# Altium project arduino_uno_PCB_Project.PrjPcb (part 2 of 2)
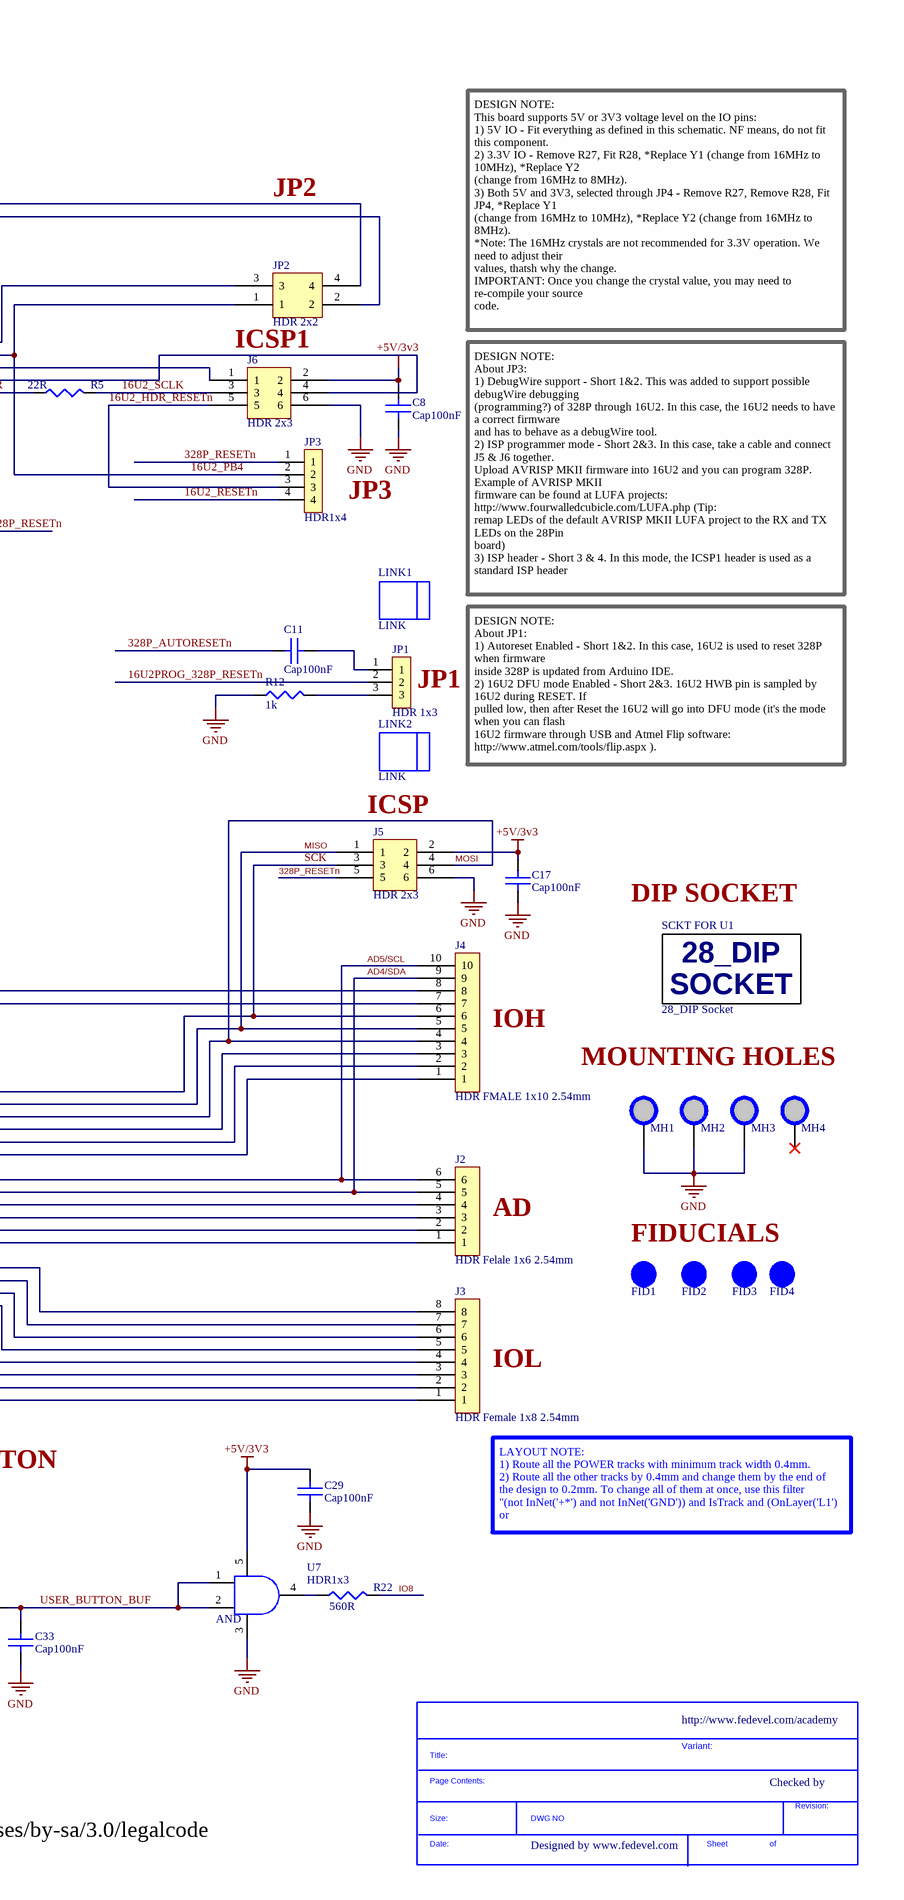
[diagram p4: [03] - 28PINS SCHEMATIC.SchDoc, right]

## Sheet [03] - 28PINS SCHEMATIC.SchDoc: 28Pins (continued)

### Library data of the parts
C1 C2 = EEE-1AA101WR: CAP ALUM 100UF 20% 10V SMD; Manufacturer: Panasonic; Ripple Current: 50mA; Life (Hours): 1000Hour; Supplier 1: Digi-Key; Supplier Part Number 1: PCE3867CT-ND; Manufacturer Part Number: EEE-1AA101WR; Stock 1: 0; Pricing 1: 1=0.35, 10=0.244, 50=0.1706, 100=0.1463, 500=0.10972 (USD); Mount: Surface Mount,PCB; Case/Package: Radial; Contact Plating: Tin; Min Operating Temperature: -40°C; Max Operating Temperature: 85°C; Capacitance: 100uF; Voltage Rating: 10V; Tolerance: 20%; Packaging: Tape and Reel; Package Quantity: 1; Ripple Current (AC): 50mA; Voltage Rating (DC): 10V; Termination: SMD/SMT; Series: S; Construction: Cylindrical; Diameter: 5mm; Length: 5.5mm; Height: 5.4mm; Height - Seated (Max): 0.213inch; Radiation Hardening: No; REACH SVHC: Unknown; Lead Free: Lead Free; RoHS Compliant: Yes; ComponentLink1URL: https://industrial.panasonic.com/cdbs/www-data/pdf/RDE0000/DME0000COL90.pdf?src-supplier=Mouser; ComponentLink1Description: https://industrial.panasonic.com/cdbs/www-data/pdf/RDE0000/DME0000COL90.pdf?src-supplier=Mouser; ComponentLink2URL: https://industrial.panasonic.com/cdbs/www-data/pdf/RDE0000/DME0000COL90.pdf?src-supplier=Allied+Electronics; ComponentLink2Description: https://industrial.panasonic.com/cdbs/www-data/pdf/RDE0000/DME0000COL90.pdf?src-supplier=Allied+Electronics; ComponentLink3URL: https://industrial.panasonic.com/cdbs/www-data/pdf/RDE0000/DME0000COL90.pdf?src-supplier=Avnet; ComponentLink3Description: https://industrial.panasonic.com/cdbs/www-data/pdf/RDE0000/DME0000COL90.pdf?src-supplier=Avnet; ComponentLink4URL: http://industrial.panasonic.com/www-data/pdf/ABA0000/ABA0000CE2.pdf?src-supplier=Future+Electronics; ComponentLink4Description: http://industrial.panasonic.com/www-data/pdf/ABA0000/ABA0000CE2.pdf?src-supplier=Future+Electronics; ComponentLink5URL: https://industrial.panasonic.com/cdbs/www-data/pdf/RDE0000/DME0000COL90.pdf?src-supplier=Verical; ComponentLink5Description: https://industrial.panasonic.com/cdbs/www-data/pdf/RDE0000/DME0000COL90.pdf?src-supplier=Verical; Category: Capacitors Aluminum Electrolytic Capacitors
C3 C12 C13 C19 C21 C22 C34 C? = C1608X6S0G106M080AC: TDK - C1608X6S0G106M080AC - Keramikvielschichtkondensator, SMD, 10 µF, 4 V, 0603 [Metrisch 1608], ± 20%, X6S, C Series; Dielectric Material: Ceramic; Capacitance: 10uF; Voltage Rating: 4V; Supplier 1: Digi-Key; Supplier Part Number 1: 445-7455-6-ND; Manufacturer: TDK; Manufacturer Part Number: C1608X6S0G106M080AC; Stock 1: 32195; Pricing 1: 1=0.36, 10=0.248, 50=0.1656, 100=0.1408, 500=0.09936, 1000=0.08694 (USD); Mount: Surface Mount; Case/Package: 0603; Number of Pins: 2; Case Code (Metric): 1608; Case Code (Imperial): 0603; Weight: 7.1E-05oz; Min Operating Temperature: -55°C; Max Operating Temperature: 105°C; Tolerance: 20%; Packaging: Tape and Reel; Package Quantity: 1; Voltage Rating (DC): 4V; Dielectric: X6S; Termination: SMD/SMT; Resistor Type: Ceramic; Series: C; Construction: Flat; Length: 1.6mm; Width: 0.031inch; Height: 0.8mm; Thickness: 0.035inch; Depth: 0.8mm; REACH SVHC: No SVHC; Lead Free: Lead Free; RoHS Compliant: Yes; ComponentLink1URL: https://product.tdk.com/info/en/catalog/spec/mlccspec_commercial_general_midvoltage_en.pdf?src-supplier=Digi-Key; ComponentLink1Description: https://product.tdk.com/info/en/catalog/spec/mlccspec_commercial_general_midvoltage_en.pdf?src-supplier=Digi-Key; ComponentLink2URL: https://product.tdk.com/info/en/catalog/datasheets/mlcc_commercial_general_en.pdf?ref_disty=digikey&src-supplier=Digi-Key; ComponentLink2Description: https://product.tdk.com/info/en/catalog/datasheets/mlcc_commercial_general_en.pdf?ref_disty=digikey&src-supplier=Digi-Key; ComponentLink3URL: http://www.mouser.com/ds/2/400/lcc_commercial_general_en-837201.pdf?src-supplier=Mouser; ComponentLink3Description: http://www.mouser.com/ds/2/400/lcc_commercial_general_en-837201.pdf?src-supplier=Mouser; Category: Capacitors Ceramic Capacitors
C4-C6 C8 C11 C14-C17 C20 C23 C24 C26 C28-C33 = CGA4J2X7R1H104K125AM: CAP CER 0.1UF 50V X7R 0805; Manufacturer: TDK; Capacitance: 100nF; Tolerance: 10%; Supplier 1: Digi-Key; Supplier Part Number 1: 445-6958-6-ND; Manufacturer Part Number: CGA4J2X7R1H104K125AM; Stock 1: 7940; Pricing 1: 1=0.2, 10=0.142, 50=0.0808, 100=0.067, 500=0.04696, 1000=0.03888 (USD); Mount: Surface Mount; Case/Package: 0805; Case Code (Metric): 2012; Case Code (Imperial): 0805; Weight: 0.000194oz; Min Operating Temperature: -55°C; Max Operating Temperature: 125°C; Package Quantity: 1; Voltage Rating: 50V; Packaging: Tape and Reel; Voltage Rating (DC): 50V; Dielectric: X7R; Termination: SMD/SMT; Resistor Type: Ceramic; Features: Soft Termination; Series: CGA; Length: 0.079inch; Width: 0.049inch; Height: 1.25mm; Thickness: 0.057inch; Depth: 1.25mm; Ratings: AEC-Q200; RoHS Compliant: Yes; ComponentLink1URL: https://product.tdk.com/info/en/documents/chara_sheet/CGA4J2X7R1H104K125AM.pdf?src-supplier=Digi-Key; ComponentLink1Description: https://product.tdk.com/info/en/documents/chara_sheet/CGA4J2X7R1H104K125AM.pdf?src-supplier=Digi-Key; ComponentLink2URL: https://product.tdk.com/info/en/catalog/datasheets/mlcc_automotive_openmode_en.pdf?src-supplier=Digi-Key; ComponentLink2Description: https://product.tdk.com/info/en/catalog/datasheets/mlcc_automotive_openmode_en.pdf?src-supplier=Digi-Key; ComponentLink3URL: http://components.arrow.com/part/dataview/57437351S460182N1165?src-supplier=Arrow+Electronics; ComponentLink3Description: http://components.arrow.com/part/dataview/57437351S460182N1165?src-supplier=Arrow+Electronics; ComponentLink4URL: http://components.arrow.com/part/dataview/0323_06888403?src-supplier=Arrow+Europe; ComponentLink4Description: http://components.arrow.com/part/dataview/0323_06888403?src-supplier=Arrow+Europe; Category: Capacitors Ceramic Capacitors
C7 = C2012X5R1E105K125AA: TDK - C2012X5R1E105K125AA - SMD Multilayer Ceramic Capacitor, 1 µF, 25 V, 0805 [2012 Metric], ± 10%, X5R, C Series; Capacitance: 1uF; Voltage Rating: 25V; Supplier 1: Digi-Key; Supplier Part Number 1: 445-1419-6-ND; Manufacturer: TDK; Manufacturer Part Number: C2012X5R1E105K125AA; Stock 1: 96448; Pricing 1: 1=0.24, 10=0.166, 50=0.0994, 100=0.0839, 500=0.0574, 1000=0.05078 (USD); Mount: Surface Mount; Case/Package: 0805; Number of Pins: 2; Case Code (Metric): 2012; Case Code (Imperial): 0805; Weight: 0.000194oz; Dielectric Material: Ceramic; Min Operating Temperature: -55°C; Max Operating Temperature: 85°C; Tolerance: 10%; Package Quantity: 2000; Packaging: Tape and Reel; Voltage Rating (DC): 25V; Dielectric: X5R; Termination: SMD/SMT; Resistor Type: Ceramic; Voltage: 25V; Series: C; Construction: Flat; Length: 2mm; Width: 0.049inch; Height: 1.25mm; Thickness: 0.057inch; Depth: 1.25mm; Radiation Hardening: No; REACH SVHC: No SVHC; Lead Free: Lead Free; RoHS Compliant: Yes; ComponentLink1URL: http://www.farnell.com/datasheets/1744655.pdf?src-supplier=Element14; ComponentLink1Description: http://www.farnell.com/datasheets/1744655.pdf?src-supplier=Element14; ComponentLink2URL: http://uk.rs-online.com/webdocs/1532/0900766b81532cd0.pdf?src-supplier=RSComponents; ComponentLink2Description: http://uk.rs-online.com/webdocs/1532/0900766b81532cd0.pdf?src-supplier=RSComponents; ComponentLink3URL: http://www.tdk.co.jp/tefe02/e412_c.pdf?src-supplier=Future+Electronics; ComponentLink3Description: http://www.tdk.co.jp/tefe02/e412_c.pdf?src-supplier=Future+Electronics; ComponentLink4URL: https://product.tdk.com/info/en/catalog/spec/mlccspec_commercial_general_midvoltage_en.pdf?src-supplier=Verical; ComponentLink4Description: https://product.tdk.com/info/en/catalog/spec/mlccspec_commercial_general_midvoltage_en.pdf?src-supplier=Verical; Category: Capacitors Ceramic Capacitors
C9 C10 C25 C27 = C0805C180C5GAC7800: CAP CER 18PF 50V NP0 0805; Manufacturer: KEMET; Dielectric Material: Ceramic; Supplier 1: Digi-Key; Supplier Part Number 1: 399-14562-6-ND; Manufacturer Part Number: C0805C180C5GAC7800; Stock 1: 2472; Pricing 1: 1=0.82, 10=0.604, 50=0.483, 100=0.414, 500=0.32776, 1000=0.276 (USD); Case/Package: 0805; Capacitance: 18pF; Voltage Rating (DC): 50V; Lead Free: Lead Free; RoHS Compliant: Yes; ComponentLink1URL: https://api.kemet.com/component-edge/download/datasheet/C0805C180C5GACTU.pdf?src-supplier=Digi-Key; ComponentLink1Description: https://api.kemet.com/component-edge/download/datasheet/C0805C180C5GACTU.pdf?src-supplier=Digi-Key; Category: Capacitors Ceramic Capacitors
D1 = LGL29K-G2J1-24-Z: LED Uni-Color Green 572nm 2-Pin Chip 0603(1608Metric) T/R; Manufacturer: Osram Opto; Lens Color: White; Forward Current: 20mA; Forward Voltage: 2.2V; Luminous Intensity: 5.6mcd; Viewing Angle: 160°; Lens Style: Flat,Diffused,Colorless,Rectangular; Test Current: 2mA; Dominant Wavelength: 570nm; Luminous Flux: 0.012lm; Number of LEDs: 1; Lens Transparency: Diffused; Reverse Voltage: 12V; Lens Size: 0.8mm; Supplier 1: Digi-Key; Supplier Part Number 1: 475-2709-1-ND; Manufacturer Part Number: LGL29K-G2J1-24-Z; Stock 1: 0; Pricing 1: 1=0.47, 10=0.31, 100=0.2071, 500=0.14322, 1000=0.11936, 2000=0.10742 (USD); Mount: Surface Mount; Case/Package: 0603; Number of Pins: 2; Color: Green; Case Code (Metric): 1608; Case Code (Imperial): 0603; Min Operating Temperature: -40°C; Max Operating Temperature: 100°C; Illumination Color: Green; Packaging: Tape and Reel; Package Quantity: 5000; Number of Elements: 1; Series: SmartLED; Length: 1.3mm; Width: 0.8mm; Height: 0.65mm; Depth: 0.8mm; Radiation Hardening: No; RoHS Compliant: Yes; ComponentLink1URL: https://dammedia.osram.info/media/resource/hires/osram-dam-2493945/LG%20L29K.pdf?src-supplier=Digi-Key; ComponentLink1Description: https://dammedia.osram.info/media/resource/hires/osram-dam-2493945/LG%20L29K.pdf?src-supplier=Digi-Key; ComponentLink2URL: http://www.mouser.com/ds/2/311/LG%20L29K%20-%20SMARTLED%200603-335234.pdf?src-supplier=Mouser; ComponentLink2Description: http://www.mouser.com/ds/2/311/LG%20L29K%20-%20SMARTLED%200603-335234.pdf?src-supplier=Mouser; ComponentLink3URL: https://www.verical.com/server-webapp/html/getDatasheet?partID=571127&src-supplier=Verical; ComponentLink3Description: https://www.verical.com/server-webapp/html/getDatasheet?partID=571127&src-supplier=Verical; Category: Optoelectronics LED Indication - Discrete
D2-D4 = LOL29K-H2K1-24-Z: OSRAM - LO L29K-H2K1-24-Z - SMARTLED 0603 ORANGE 55AC2374; Manufacturer: Osram Opto; Lens Color: White; Forward Current: 20mA; Forward Voltage: 2.2V; Luminous Intensity: 9mcd; Viewing Angle: 160°; Lens Style: Flat,Diffused,Colorless,Rectangular; Test Current: 2mA; Dominant Wavelength: 606nm; Luminous Flux: 0.025lm; Number of LEDs: 1; Lens Transparency: Diffused; Reverse Voltage: 12V; Lens Size: 0.8mm; Supplier 1: Digi-Key; Supplier Part Number 1: 475-2740-1-ND; Manufacturer Part Number: LOL29K-H2K1-24-Z; Stock 1: 5754; Pricing 1: 1=0.46, 10=0.3, 100=0.2001, 500=0.1384, 1000=0.11533, 2000=0.1038 (USD); Mount: Surface Mount; Case/Package: 0603; Number of Pins: 2; Color: Orange; Case Code (Metric): 1608; Case Code (Imperial): 0603; Min Operating Temperature: -40°C; Max Operating Temperature: 100°C; Illumination Color: Orange; Packaging: Tape and Reel; Package Quantity: 5000; Number of Elements: 1; Series: SmartLED; Length: 1.3mm; Width: 0.8mm; Height: 0.65mm; Depth: 0.8mm; Radiation Hardening: No; RoHS Compliant: Yes; ComponentLink1URL: https://dammedia.osram.info/media/resource/hires/osram-dam-2493882/LO%20L29K.pdf?src-supplier=Digi-Key; ComponentLink1Description: https://dammedia.osram.info/media/resource/hires/osram-dam-2493882/LO%20L29K.pdf?src-supplier=Digi-Key; ComponentLink2URL: https://www.verical.com/server-webapp/html/getDatasheet?partID=693885&src-supplier=Verical; ComponentLink2Description: https://www.verical.com/server-webapp/html/getDatasheet?partID=693885&src-supplier=Verical; Category: Optoelectronics LED Indication - Discrete
D5 D6 = BAT54HT1G: Small Signal Schottky Diode, Single, 30 V, 200 Ma, 800 Mv, 600 Ma, 150 C; Manufacturer: ON Semiconductor / Fairchild; Forward Voltage: 800mV; Forward Current: 200mA; Recovery Time: 5ns; Max Repetitive Reverse Voltage (Vrrm): 30V; Peak Non-Repetitive Surge Current: 600mA; Max Reverse Current: 2uA; Power Dissipation: 200mW; Polarity: Standard; Capacitance: 10pF; Supplier 1: Digi-Key; Supplier Part Number 1: BAT54HT1GOSCT-ND; Manufacturer Part Number: BAT54HT1G; Stock 1: 0; Pricing 1: 1=0.24, 10=0.199, 100=0.1057, 500=0.06956, 1000=0.0473 (USD); Mount: Surface Mount; Number of Pins: 2; Contact Plating: Tin,Matte; Min Operating Temperature: -55°C; Max Operating Temperature: 150°C; Packaging: Tape and Reel; Package Quantity: 3000; Average Rectified Current: 200mA; Reverse Recovery Time: 5ns; Max Forward Surge Current (Ifsm): 600mA; Element Configuration: Single; Max Reverse Voltage (DC): 30V; Max Surge Current: 600mA; Voltage Rating (DC): 30V; Current Rating: 200mA; Output Current: 200mA; Reverse Voltage: 30V; Max Reverse Leakage Current: 2uA; Length: 1.8mm; Width: 1.35mm; Height: 1mm; Radiation Hardening: No; Lead Free: Lead Free; REACH SVHC: No SVHC; RoHS Compliant: Yes; ComponentLink1URL: http://www.fairchildsemi.com/datasheets/BA/BAT54HT1G.pdf?src-supplier=Digi-Key; ComponentLink1Description: http://www.fairchildsemi.com/datasheets/BA/BAT54HT1G.pdf?src-supplier=Digi-Key; ComponentLink2URL: http://www.jameco.com/Jameco/Products/ProdDS/806549.pdf?src-supplier=Jameco; ComponentLink2Description: http://www.jameco.com/Jameco/Products/ProdDS/806549.pdf?src-supplier=Jameco; ComponentLink3URL: http://uk.rs-online.com/webdocs/11a6/0900766b811a63a9.pdf?src-supplier=RSComponents; ComponentLink3Description: http://uk.rs-online.com/webdocs/11a6/0900766b811a63a9.pdf?src-supplier=RSComponents; ComponentLink4URL: http://www.fairchildsemi.com/ds/BA/BAT54HT1G.pdf?src-supplier=Future+Electronics; ComponentLink4Description: http://www.fairchildsemi.com/ds/BA/BAT54HT1G.pdf?src-supplier=Future+Electronics; ComponentLink5URL: https://media.digikey.com/pdf/Data%20Sheets/Fairchild%20PDFs/BAT54HT1G_Rev_1.2.pdf?src-supplier=Avnet; ComponentLink5Description: https://media.digikey.com/pdf/Data%20Sheets/Fairchild%20PDFs/BAT54HT1G_Rev_1.2.pdf?src-supplier=Avnet; ComponentLink6URL: http://www.onsemi.com/pub/Collateral/BAT54HT1-D.PDF?src-supplier=Avnet; ComponentLink6Description: http://www.onsemi.com/pub/Collateral/BAT54HT1-D.PDF?src-supplier=Avnet; ComponentLink7URL: https://media.digikey.com/pdf/Data%20Sheets/Fairchild%20PDFs/BAT54HT1G_Rev_1.2.pdf?src-supplier=Mouser; ComponentLink7Description: https://media.digikey.com/pdf/Data%20Sheets/Fairchild%20PDFs/BAT54HT1G_Rev_1.2.pdf?src-supplier=Mouser; ComponentLink8URL: http://www.mouser.com/ds/2/149/BAT54HT1G-104602.pdf?src-supplier=Mouser; ComponentLink8Description: http://www.mouser.com/ds/2/149/BAT54HT1G-104602.pdf?src-supplier=Mouser; ComponentLink9URL: http://www.farnell.com/datasheets/2251626.pdf?src-supplier=Newark; ComponentLink9Description: http://www.farnell.com/datasheets/2251626.pdf?src-supplier=Newark; ComponentLink10URL: http://www.farnell.com/datasheets/2251626.pdf?src-supplier=Element14; ComponentLink10Description: http://www.farnell.com/datasheets/2251626.pdf?src-supplier=Element14; ComponentLink11URL: http://www.onsemi.com/pub/Collateral/BAT54HT1-D.PDF?src-supplier=Digi-Key; ComponentLink11Description: http://www.onsemi.com/pub/Collateral/BAT54HT1-D.PDF?src-supplier=Digi-Key; ComponentLink12URL: http://www.farnell.com/datasheets/1727620.pdf?src-supplier=Element14; ComponentLink12Description: http://www.farnell.com/datasheets/1727620.pdf?src-supplier=Element14; ComponentLink13URL: http://www.produktinfo.conrad.com/datenblaetter/1200000-1299999/001262925-da-01-en-DIODE_SCHOTTKY_30V_BAT54HT1G_SOD_323_FSC.pdf?src-supplier=Conrad; ComponentLink13Description: http://www.produktinfo.conrad.com/datenblaetter/1200000-1299999/001262925-da-01-en-DIODE_SCHOTTKY_30V_BAT54HT1G_SOD_323_FSC.pdf?src-supplier=Conrad; Category: Discrete Semiconductor Products Diodes - Rectifiers - Single
FB1-FB3 = MPZ2012S601AT000: Ferrite Beads Multi-Layer Power 600Ohm 25% 100MHz 2A 100mOhm DCR 0805 T/R; Manufacturer: TDK; Impedance: 600R; DC Resistance (DCR): 100mR; Supplier 1: Digi-Key; Supplier Part Number 1: 445-2206-1-ND; Manufacturer Part Number: MPZ2012S601AT000; Stock 1: 0; Pricing 1: 1=0.12, 10=0.101, 25=0.0904, 50=0.0664, 100=0.0574, 250=0.04528, 500=0.03824, 1000=0.03221 (USD); Mount: Surface Mount; Case/Package: 0805; Case Code (Metric): 2012; Case Code (Imperial): 0805; Packaging: Tape and Reel; Package Quantity: 1; Current Rating: 2A; Max DC Current: 2A; Series: MPZ; Length: 0.079inch; Width: 0.049inch; Height: 0.041inch; REACH SVHC: No SVHC; Lead Free: Lead Free; RoHS Compliant: Yes; ComponentLink1URL: https://product.tdk.com/info/en/catalog/datasheets/beads_commercial_power_mpz2012_en.pdf?src-supplier=Digi-Key; ComponentLink1Description: https://product.tdk.com/info/en/catalog/datasheets/beads_commercial_power_mpz2012_en.pdf?src-supplier=Digi-Key; ComponentLink2URL: https://media.digikey.com/pdf/Data%20Sheets/TDK%20PDFs/MPZ_Series_Br.pdf?src-supplier=Digi-Key; ComponentLink2Description: https://media.digikey.com/pdf/Data%20Sheets/TDK%20PDFs/MPZ_Series_Br.pdf?src-supplier=Digi-Key; Category: Filters Ferrite Beads and Chips
FID1-FID4 = FID_1MMC: Fiducial 40 mil Diameter,120mil Mask
J1 J3 = PPTC081LFBN-RC: CONN HDR 8POS 0.1 TIN PCB; Manufacturer: Sullins; Number of Positions: 8; Connector Type: Header; Pitch: 0.1inch; Supplier 1: Digi-Key; Supplier Part Number 1: S7006-ND; Manufacturer Part Number: PPTC081LFBN-RC; Stock 1: 153855; Pricing 1: 1=0.65, 10=0.565, 400=0.42525, 800=0.3645, 1200=0.33413, 5200=0.29363, 10000=0.2925 (USD); Mount: Through Hole; Color: Black; Contact Plating: Tin; Contact Material: Bronze; Housing Material: Plastic; Package Quantity: 1000; Number of Rows: 1; Packaging: Bulk; Termination: Solder; Contact Type: Female Socket; Length: 20.8mm; Width: 2.5mm; Height: 8.5mm; Lead Free: Lead Free; RoHS Compliant: Yes; Category: Connectors, Interconnects Rectangular Connectors - Headers, Receptacles, Female Sockets
J2 = PPTC061LFBN-RC: Female, 6 C, Straight, .100"CC; 3.20mm Tail, No Mt. 100u" Tin; PBT, Phos Bronze, 105 C; Manufacturer: Sullins; Number of Positions: 6; Connector Type: Header; Pitch: 0.1inch; Supplier 1: Digi-Key; Supplier Part Number 1: S7004-ND; Manufacturer Part Number: PPTC061LFBN-RC; Stock 1: 128145; Pricing 1: 1=0.52, 10=0.449, 80=0.3705, 440=0.3222, 1000=0.26582, 5000=0.2336, 10000=0.2327 (USD); Mount: Through Hole; Color: Black; Contact Plating: Tin; Contact Material: Bronze; Housing Material: Plastic; Package Quantity: 1000; Packaging: Bulk; Number of Rows: 1; Termination: Solder; Contact Type: Female Socket; Length: 15.7mm; Width: 2.5mm; Height: 8.5mm; Lead Free: Lead Free; RoHS Compliant: Yes; Category: Connectors, Interconnects Rectangular Connectors - Headers, Receptacles, Female Sockets
J4 = PPTC101LFBN-RC: CONN HDR 10POS 0.1 TIN PCB; Manufacturer: Sullins; Number of Positions: 10; Connector Type: Header; Pitch: 0.1inch; Supplier 1: Digi-Key; Supplier Part Number 1: S7008-ND; Manufacturer Part Number: PPTC101LFBN-RC; Stock 1: 7943; Pricing 1: 1=0.65, 10=0.551, 320=0.45, 640=0.405, 960=0.36, 5120=0.325 (USD); Mount: Through Hole; Color: Black; Contact Plating: Tin; Contact Material: Bronze; Housing Material: Plastic; Package Quantity: 1000; Number of Rows: 1; Packaging: Bulk; Termination: Solder; Contact Type: Female Socket; Length: 25.9mm; Width: 2.5mm; Height: 8.5mm; Lead Free: Lead Free; RoHS Compliant: Yes; Category: Connectors, Interconnects Rectangular Connectors - Headers, Receptacles, Female Sockets
J5 J6 = 67997-206HLF: Conn Unshrouded Header HDR 6 POS 2.54mm Solder ST Top Entry Thru-Hole BergStik® Bulk; Manufacturer: Amphenol ICC / FCI; Supplier 1: Digi-Key; Supplier Part Number 1: 609-3234-ND; Manufacturer Part Number: 67997-206HLF; Stock 1: 20290; Pricing 1: 1=0.42, 10=0.361, 100=0.2804, 500=0.24034, 1000=0.20029, 5000=0.17168, 10000=0.16023 (USD); Category: Connectors, Interconnects,Rectangular Connectors - Headers, Male Pins
J7 = 10118193-0001LF: CONN USB MICRO B RECPT SMT R/A; Manufacturer: Amphenol ICC / FCI; Supplier 1: Digi-Key; Supplier Part Number 1: 609-4616-6-ND; Manufacturer Part Number: 10118193-0001LF; Stock 1: 209625; Pricing 1: 1=0.45, 10=0.397, 25=0.3624, 50=0.3412, 100=0.327, 250=0.29856, 500=0.28434 (USD); Category: Connectors, Interconnects USB, DVI, HDMI Connectors
J8 J9 = PAD_WITH_HOLE_4MMx1.5MM: pad_with_hole_4mmx10.5mm
JP1 JP4 = 68001-203HLF: Conn Unshrouded Header HDR 3 POS 2.54mm Solder ST Top Entry Thru-Hole BergStik® Bulk; Manufacturer: Amphenol ICC / FCI; Supplier 1: Digi-Key; Supplier Part Number 1: 609-3470-ND; Manufacturer Part Number: 68001-203HLF; Stock 1: 11655; Pricing 1: 1=0.24, 10=0.205, 100=0.1576, 500=0.13332, 1000=0.10908, 5000=0.09696, 10000=0.08787 (USD); Category: Connectors, Interconnects,Rectangular Connectors - Headers, Male Pins
JP2 = 67996-204HLF: CONN HEADER 4POS .100 STR 15AU; Manufacturer: Amphenol ICC / FCI; Current Rating: 3A; Voltage Rating: 1.5kV; Number of Positions: 4; Gender: Male; Connector Type: Male Pin; Insulation Resistance: 5GR; Pitch: 2.54mm; Row Spacing: 0.1inch; Contact Post Length: 2.41mm; Supplier 1: Digi-Key; Supplier Part Number 1: 609-3209-ND; Manufacturer Part Number: 67996-204HLF; Stock 1: 2285; Pricing 1: 1=0.37, 10=0.318, 100=0.2475, 500=0.21212, 1000=0.17677, 5000=0.15152, 10000=0.14141 (USD); Mount: Through Hole; Contact Plating: Gold,GXT; Contact Material: Bronze; Color: Black; Housing Color: Black; Housing Material: Thermoplastic; Min Operating Temperature: -65°C; Max Operating Temperature: 125°C; Number of Rows: 2; Package Quantity: 100; Packaging: Bulk; Termination: Solder; Max Voltage Rating (AC): 1.5kV; Number of Contacts: 4; Orientation: Straight; Series: BERGSTIK® II, MezzSelect™, Basics+; Contact Gender: Male; Contact Type: Male Pin; Length: 5.08mm; Depth: 4.83mm; Contact Mating Length: 0.23inch; Radiation Hardening: No; RoHS Compliant: Yes; ComponentLink1URL: https://cdn.amphenol-icc.com/media/wysiwyg/files/drawing/67996.pdf?src-supplier=Digi-Key; ComponentLink1Description: https://cdn.amphenol-icc.com/media/wysiwyg/files/drawing/67996.pdf?src-supplier=Digi-Key; ComponentLink2URL: http://portal.fciconnect.com/Comergent/adirect/fci?cmd=catCustomerDrawing&productName=67996-204HLF&src-supplier=Mouser; ComponentLink2Description: http://portal.fciconnect.com/Comergent/adirect/fci?cmd=catCustomerDrawing&productName=67996-204HLF&src-supplier=Mouser; ComponentLink3URL: http://portal.fciconnect.com/Comergent/fci/drawing/67996.pdf?src-supplier=Avnet; ComponentLink3Description: http://portal.fciconnect.com/Comergent/fci/drawing/67996.pdf?src-supplier=Avnet; ComponentLink4URL: https://www.alliedelec.com/m/d/53bb23c358fc256e41050113d473e6c3.pdf?src-supplier=Allied+Electronics; ComponentLink4Description: https://www.alliedelec.com/m/d/53bb23c358fc256e41050113d473e6c3.pdf?src-supplier=Allied+Electronics; Category: Connectors, Interconnects,Rectangular Connectors - Headers, Male Pins
JP3 = 68002-404HLF: Board Connector, 4 Contact(s), 1 Row(s), Male, Straight, Solder Terminal; Manufacturer: Amphenol ICC; Supplier 1: Digi-Key; Supplier Part Number 1: 609-3305-ND; Manufacturer Part Number: 68002-404HLF; Stock 1: 1260; Pricing 1: 1=0.25, 10=0.209, 100=0.1611, 500=0.13628, 1000=0.11151, 5000=0.09912, 10000=0.08983 (USD); Category: Connectors, Interconnects,Rectangular Connectors - Headers, Male Pins
L1 = L1210R2R2MDWIT: KEMET         L1210R2R2MDWIT             Product Range:L-DWI Series; Core Material: Ferrite; Current Rating: 2A; Tolerance: 20%; Shielding: Unshielded; Self Resonant Frequency: 190MHz; Inductance: 2.2uH; DC Resistance (DCR): 80mR; Test Frequency: 100kHz; DC Current: 1.13A; Supplier 1: Digi-Key; Supplier Part Number 1: 399-9598-6-ND; Manufacturer: KEMET; Manufacturer Part Number: L1210R2R2MDWIT; Stock 1: 6735; Pricing 1: 1=0.5, 10=0.437, 25=0.406, 50=0.3436, 100=0.3124, 250=0.29364, 500=0.2624 (USD); Mount: Surface Mount; Case/Package: 1210; Case Code (Metric): 3225; Case Code (Imperial): 1210; Min Operating Temperature: -40°C; Max Operating Temperature: 105°C; Package Quantity: 1000; Packaging: Tape and Reel; Inductance Tolerance: 20%; Resistor Type: Wirewound,Ceramic; Max DC Current: 2A; Termination: SMD/SMT; Series: L-DWI; Length: 0.126inch; Width: 0.098inch; Height: 2.5mm; Height - Seated (Max): 0.106inch; Depth: 2.7mm; Radiation Hardening: No; REACH SVHC: No SVHC; Military Standard: Not; RoHS Compliant: Yes; ComponentLink1URL: http://www.farnell.com/datasheets/27262.pdf?src-supplier=Element14; ComponentLink1Description: http://www.farnell.com/datasheets/27262.pdf?src-supplier=Element14; ComponentLink2URL: https://api.kemet.com/component-edge/download/datasheet/L1210R2R2MDWIT.pdf?src-supplier=Digi-Key; ComponentLink2Description: https://api.kemet.com/component-edge/download/datasheet/L1210R2R2MDWIT.pdf?src-supplier=Digi-Key; ComponentLink3URL: https://content.kemet.com/datasheets/F3115.pdf?src-supplier=Mouser; ComponentLink3Description: https://content.kemet.com/datasheets/F3115.pdf?src-supplier=Mouser; ComponentLink4URL: http://www.kemet.com/Lists/ProductCatalog/Attachments/57/F3115.pdf?src-supplier=Avnet; ComponentLink4Description: http://www.kemet.com/Lists/ProductCatalog/Attachments/57/F3115.pdf?src-supplier=Avnet; ComponentLink5URL: https://content.kemet.com/datasheets/F3115.pdf?src-supplier=Avnet+Europe; ComponentLink5Description: https://content.kemet.com/datasheets/F3115.pdf?src-supplier=Avnet+Europe; Category: Inductors, Coils, Chokes Fixed Inductors
LINK1-LINK3 = QPC02SXGN-RC: CONN JUMPER SHORTING .100" GOLD; Manufacturer: Sullins; Number of Positions: 2; Pitch: 0.1inch; Supplier 1: Digi-Key; Supplier Part Number 1: S9337-ND; Manufacturer Part Number: QPC02SXGN-RC; Stock 1: 721504; Pricing 1: 1=0.1, 10=0.05, 25=0.0408, 50=0.0378, 100=0.0365, 250=0.03152, 500=0.03024, 1000=0.02646, 2500=0.02394 (USD); Case/Package: 100; Contact Plating: Gold; Package Quantity: 2000; Packaging: Bulk; Height: 0.235inch; Lead Free: Lead Free; ComponentLink1URL: https://s3.amazonaws.com/catalogspreads-pdf/PAGE128-129%20.100%20JUMPER.pdf?src-supplier=Digi-Key; ComponentLink1Description: https://s3.amazonaws.com/catalogspreads-pdf/PAGE128-129%20.100%20JUMPER.pdf?src-supplier=Digi-Key; Category: Connectors, Interconnects Shunts, Jumpers
MH1-MH3 = MH_7.4MMC3.2MMD: Mounting Hole 7.4mm Diameter,3.2mm Drill
MH4 = MH_7.4MMNC_3.2MMD: Hole 7.4mm Diameter (Non Copper), 3.2mm Drill NPHT
R1 = RE0805FRE07100KL: Fixed Resistor, Metal Glaze/thick Film, 0.125W, 100000ohm, 150V, 1% +/-Tol, 50ppm/°C SMD 0805; Manufacturer: Yageo; Resistance: 100kR; Max Power Dissipation: 125mW; Supplier 1: Digi-Key; Supplier Part Number 1: 13-RE0805FRE07100KLDKR-ND; Manufacturer Part Number: RE0805FRE07100KL; Stock 1: 8480; Pricing 1: 1=0.1, 10=0.046, 100=0.0185, 1000=0.00832, 2500=0.00722 (USD); Case/Package: 0805; Min Operating Temperature: -55°C; Max Operating Temperature: 155°C; Packaging: Tape and Reel; Resistor Type: Thick Film; Number of Terminations: 2; Tolerance: 1%; Temperature Coefficient: 50ppm/°C; Features: Moisture Resistant; Length: 0.079inch; Width: 0.049inch; Height: 0.024inch; Lead Free: Lead Free; RoHS Compliant: Yes; ComponentLink1URL: http://www.yageo.com/NewPortal/yageodocoutput?fileName=/pdf/R-Chip/PYu-RE_105_RoHS_L_4.pdf&src-supplier=Digi-Key; ComponentLink1Description: http://www.yageo.com/NewPortal/yageodocoutput?fileName=/pdf/R-Chip/PYu-RE_105_RoHS_L_4.pdf&src-supplier=Digi-Key; ComponentLink2URL: https://datasheet.octopart.com/RE0805FRE07100KL-Yageo-datasheet-24910706.pdf?src-supplier=Future+Electronics; ComponentLink2Description: https://datasheet.octopart.com/RE0805FRE07100KL-Yageo-datasheet-24910706.pdf?src-supplier=Future+Electronics; ComponentLink3URL: https://datasheet.octopart.com/RE0805FRE07100KL-Yageo-datasheet-61253463.pdf?src-supplier=Future+Electronics; ComponentLink3Description: https://datasheet.octopart.com/RE0805FRE07100KL-Yageo-datasheet-61253463.pdf?src-supplier=Future+Electronics; ComponentLink4URL: https://datasheet.octopart.com/RE0805FRE07100KL-Yageo-datasheet-62044470.pdf?src-supplier=Future+Electronics; ComponentLink4Description: https://datasheet.octopart.com/RE0805FRE07100KL-Yageo-datasheet-62044470.pdf?src-supplier=Future+Electronics; ComponentLink5URL: https://datasheet.octopart.com/RE0805FRE07100KL-Yageo-datasheet-68298056.pdf?src-supplier=Future+Electronics; ComponentLink5Description: https://datasheet.octopart.com/RE0805FRE07100KL-Yageo-datasheet-68298056.pdf?src-supplier=Future+Electronics; ComponentLink6URL: https://datasheet.octopart.com/RE0805FRE07100KL-Yageo-datasheet-68296309.pdf?src-supplier=Future+Electronics; ComponentLink6Description: https://datasheet.octopart.com/RE0805FRE07100KL-Yageo-datasheet-68296309.pdf?src-supplier=Future+Electronics; ComponentLink7URL: https://datasheet.octopart.com/RE0805FRE07100KL-Yageo-datasheet-137700563.pdf?src-supplier=Future+Electronics; ComponentLink7Description: https://datasheet.octopart.com/RE0805FRE07100KL-Yageo-datasheet-137700563.pdf?src-supplier=Future+Electronics; ComponentLink8URL: https://datasheet.octopart.com/RE0805FRE07100KL-Yageo-datasheet-86798388.pdf; ComponentLink8Description: https://datasheet.octopart.com/RE0805FRE07100KL-Yageo-datasheet-86798388.pdf; Category: Resistors Chip Resistor - Surface Mount
R2 R3 R15 R17 R22 = AC0805FR-07560RL: Thick Film Resistors - SMD 1/8W 560ohm 1% AEC-Q200; Manufacturer: Yageo; Voltage Rating: 150V; Power Rating: 125mW; Temperature Coefficient: 100ppm/°C; Supplier 1: Digi-Key; Supplier Part Number 1: YAG3743DKR-ND; Manufacturer Part Number: AC0805FR-07560RL; Stock 1: 2339; Pricing 1: 1=0.1, 10=0.05, 100=0.0204, 1000=0.00917, 2500=0.00796 (USD); Case/Package: 0805; Case Code (Imperial): 0805; Case Code (Metric): 2012; Weight: 0.000194oz; Min Operating Temperature: -55°C; Max Operating Temperature: 155°C; Resistance: 560R; Tolerance: 1%; Packaging: Tape and Reel; Resistor Type: Thick Film; Number of Terminations: 2; Termination: SMD/SMT; Max Power Dissipation: 125mW; Features: Moisture Resistant,Automotive AEC-Q200; Series: AC; Length: 0.079inch; Width: 0.049inch; Height: 0.024inch; RoHS Compliant: Yes; ComponentLink1URL: http://www.mouser.com/ds/2/447/yageodocoutput-1111992.pdf?src-supplier=Mouser; ComponentLink1Description: http://www.mouser.com/ds/2/447/yageodocoutput-1111992.pdf?src-supplier=Mouser; Category: Resistors Chip Resistor - Surface Mount
R4 R14 R18-R21 = AC0805FR-071KL: RES SMD 1K OHM 1% 1/8W 0805; Manufacturer: Yageo; Resistance: 1kR; Power Rating: 125mW; Voltage Rating: 150V; Temperature Coefficient: 100ppm/°C; Supplier 1: Digi-Key; Supplier Part Number 1: YAG3703DKR-ND; Manufacturer Part Number: AC0805FR-071KL; Stock 1: 147840; Pricing 1: 1=0.1, 10=0.05, 100=0.0204, 1000=0.00917, 2500=0.00796 (USD); Case/Package: 0805; Case Code (Imperial): 0805; Case Code (Metric): 2012; Min Operating Temperature: -55°C; Max Operating Temperature: 155°C; Tolerance: 1%; Packaging: Tape and Reel; Termination: SMD/SMT; Resistor Type: Thick Film; Number of Terminations: 2; Max Power Dissipation: 125mW; Features: Moisture Resistant,Automotive AEC-Q200; Series: AC; Construction: Rectangular; Length: 2mm; Width: 1.25mm; Height: 0.024inch; Depth: 1.25mm; Military Standard: Not; Lead Free: Lead Free; RoHS Compliant: Yes; ComponentLink1URL: https://www.verical.com/server-webapp/html/getDatasheet?partID=732555&src-supplier=Verical; ComponentLink1Description: https://www.verical.com/server-webapp/html/getDatasheet?partID=732555&src-supplier=Verical; Category: Resistors Chip Resistor - Surface Mount
R5-R7 R13 R23-R25 = RC0805FR-072R2L: YAGEO         RC0805FR-072R2L             RES, THICK FILM, 2R2, 1%, 0.125W, 0805; Resistance: 2.2R; Power Rating: 125mW; Voltage Rating: 150V; Temperature Coefficient: 200ppm/°C; Supplier 1: Digi-Key; Supplier Part Number 1: 311-2.20CRDKR-ND; Manufacturer: Yageo; Manufacturer Part Number: RC0805FR-072R2L; Stock 1: 3784; Pricing 1: 1=0.1, 10=0.083, 100=0.0339, 1000=0.01521, 2500=0.0132 (USD); Case/Package: 0805; Number of Pins: 2; Case Code (Imperial): 0805; Case Code (Metric): 2012; Size Code: 0805; Min Operating Temperature: -55°C; Max Operating Temperature: 155°C; Tolerance: 1%; Packaging: Tape and Reel; Termination: SMD/SMT; Resistor Type: Thick Film; Features: Moisture Resistant; Series: RC; Max Power Dissipation: 125mW; Number of Terminations: 2; Construction: Rectangular; Resistance Tolerance: 1%; Technology: THICK FILM; Voltage Rating (DC): 150V; Length: 2mm; Width: 1.25mm; Height: 0.5mm; Depth: 1.25mm; REACH SVHC: No SVHC; Military Standard: Not; Lead Free: Lead Free; RoHS Compliant: Yes; ComponentLink1URL: http://www.farnell.com/datasheets/444164.pdf?src-supplier=Element14; ComponentLink1Description: http://www.farnell.com/datasheets/444164.pdf?src-supplier=Element14; Category: Resistors Chip Resistor - Surface Mount
R8 R26-R28 = CR0805AJ/-000EAS: Res Anti-Sulfured Jumper Thick Film 0805 0 Ohm 1/8W Molded Paper T/R; Manufacturer: Bourns; Supplier 1: Digi-Key; Supplier Part Number 1: CR0805AJ/-000EASDKR-ND; Manufacturer Part Number: CR0805AJ/-000EAS; Stock 1: 2212; Pricing 1: 1=0.1, 10=0.067, 100=0.0271, 1000=0.01219, 2500=0.01058 (USD); ComponentLink1URL: https://www.bourns.com/docs/product-datasheets/crxxxxa-as.pdf?src-supplier=Digi-Key; ComponentLink1Description: https://www.bourns.com/docs/product-datasheets/crxxxxa-as.pdf?src-supplier=Digi-Key; Category: Resistors Chip Resistor - Surface Mount
R9 R16 = RMCF0805ZT0R00: STACKPOLE ELECTRONICS - RMCF0805ZT0R00. - RES THKFLM 0805 0 OHM JUMPER 1/8W 200PPM/ C SMD ROHS COMPLIANT: YES; Resistance: 0R; Power Rating: 125mW; Supplier 1: Digi-Key; Supplier Part Number 1: RMCF0805ZT0R00DKR-ND; Manufacturer: Stackpole Electronics; Manufacturer Part Number: RMCF0805ZT0R00; Stock 1: 35384; Pricing 1: 1=0.1, 10=0.017, 25=0.0128, 50=0.0096, 100=0.0071, 250=0.0054, 500=0.00432, 1000=0.00318 (USD); Mount: Surface Mount; Case/Package: 0805; Case Code (Metric): 2012; Case Code (Imperial): 0805; Contact Plating: Tin,Matte; Size Code: 0805; Min Operating Temperature: -55°C; Max Operating Temperature: 155°C; Packaging: Tape and Reel; Resistor Type: Thick Film; Number of Terminations: 2; Max Power Dissipation: 125mW; Features: Automotive AEC-Q200; Series: RMCF; Construction: Rectangular; Length: 2mm; Width: 0.049inch; Height: 0.026inch; Depth: 1.25mm; Radiation Hardening: No; Lead Free: Lead Free; Military Standard: Not; RoHS Compliant: Yes; ComponentLink1URL: https://www.verical.com/server-webapp/html/getDatasheet?partID=360417&src-supplier=Verical; ComponentLink1Description: https://www.verical.com/server-webapp/html/getDatasheet?partID=360417&src-supplier=Verical
R10-R12 = RC0805FR-101KL: Res Thick Film 0805 1K Ohm 1% 0.125W(1/8W) ±100ppm/C Pad SMD T/R; Manufacturer: Yageo; Resistance: 1kR; Power Rating: 125mW; Voltage Rating: 150V; Temperature Coefficient: 100ppm/°C; Supplier 1: Digi-Key; Supplier Part Number 1: 13-RC0805FR-101KLTR-ND; Manufacturer Part Number: RC0805FR-101KL; Stock 1: 0; Pricing 1: 10000=0.00473 (USD); Case/Package: 0805; Case Code (Imperial): 0805; Case Code (Metric): 2012; Contact Plating: Tin,Matte,Lead; Min Operating Temperature: -55°C; Max Operating Temperature: 155°C; Tolerance: 1%; Packaging: Tape and Reel; Resistor Type: Thick Film; Termination: SMD/SMT; Voltage Rating (DC): 150V; Series: RC; Resistance Tolerance: 1%; Construction: Rectangular; Length: 2mm; Width: 1.25mm; Height: 0.5mm; Depth: 1.25mm; Radiation Hardening: No; REACH SVHC: No SVHC; Military Standard: Not; RoHS Compliant: Yes; ComponentLink1URL: http://www.farnell.com/datasheets/444164.pdf?src-supplier=Element14; ComponentLink1Description: http://www.farnell.com/datasheets/444164.pdf?src-supplier=Element14; ComponentLink2URL: http://www.mouser.com/ds/2/447/Yageo_08112016_RC0805-968729.pdf?src-supplier=Mouser; ComponentLink2Description: http://www.mouser.com/ds/2/447/Yageo_08112016_RC0805-968729.pdf?src-supplier=Mouser; ComponentLink3URL: https://datasheet.octopart.com/RC0805FR-101KL-Yageo-datasheet-8330313.pdf?src-supplier=Element14; ComponentLink3Description: https://datasheet.octopart.com/RC0805FR-101KL-Yageo-datasheet-8330313.pdf?src-supplier=Element14; ComponentLink4URL: https://datasheet.octopart.com/RC0805FR-101KL-Yageo-datasheet-73766026.pdf; ComponentLink4Description: https://datasheet.octopart.com/RC0805FR-101KL-Yageo-datasheet-73766026.pdf; Category: Resistors Chip Resistor - Surface Mount
SCKT_FOR_U1 = 4828-3004-CP: CONN IC DIP SOCKET 28POS TIN; Manufacturer: 3M; Insulation Resistance: 5GR; Number of Positions: 28; Current Rating: 1A; Gender: Female; Pitch: 2.54mm; Row Spacing: 7.62mm; Supplier 1: Digi-Key; Supplier Part Number 1: 3M5480-ND; Manufacturer Part Number: 4828-3004-CP; Stock 1: 5327; Pricing 1: 1=0.9, 10=0.762, 25=0.7304, 40=0.715, 80=0.68388, 230=0.62174, 440=0.55959, 945=0.49741, 2400=0.45078 (USD); Mount: Through Hole; Contact Plating: Tin; Contact Material: Bronze; Housing Material: Glass; Insulation Material: Polyester; Min Operating Temperature: -25°C; Max Operating Temperature: 85°C; Package Quantity: 5600; Number of Rows: 2; Termination: Solder; Connector Type: DIP; Number of Contacts: 28; Orientation: Straight; Series: 4800; Length: 35.43mm; Width: 10.16mm; Depth: 10.16mm; REACH SVHC: Unknown; Lead Free: Lead Free; ComponentLink1URL: http://multimedia.3m.com/mws/media/218496O/3mtm-dip-socket-4800-series-ts1099.pdf?src-supplier=Digi-Key; ComponentLink1Description: http://multimedia.3m.com/mws/media/218496O/3mtm-dip-socket-4800-series-ts1099.pdf?src-supplier=Digi-Key
sw1 sw2 = 1825910-6: 6X6, H5,  160G TAC.SWITCH; Manufacturer: TE Connectivity Alcoswitch; Mechanical Life: 100000Cycles; Actuator Material: PBT; Actuator Color: Black; Max Current Rating: 50mA; Throw Configuration: SPST; Operating Force: 160gf; Max Voltage Rating (DC): 24V; Contact Resistance: 100mR; Illumination Type: Non-Illuminated,Illuminated; Switch Travel: 0.25mm; Switch Function: Off-Mom; Actuator Type: Standard; Actuator Length: 0.055inch; Supplier 1: Digi-Key; Supplier Part Number 1: 450-1650-ND; Manufacturer Part Number: 1825910-6; Stock 1: 141342; Pricing 1: 1=0.11, 10=0.111, 25=0.1052, 100=0.0955, 250=0.0898, 500=0.08216, 1000=0.06879, 2500=0.06688, 5000=0.06306 (USD); Mount: Through Hole; Contact Material: Copper Alloy; Contact Plating: Silver; Min Operating Temperature: -35°C; Max Operating Temperature: 85°C; Package Quantity: 750; Packaging: Loose Piece; Termination: PC Pins; Electrical Life: 100000Cycles; Orientation: Straight; Contact Current Rating: 50mA; Type: Switch; Series: FSMJ; Length: 5.99mm; RoHS Compliant: Yes; REACH SVHC: Unknown; ELV: Compliant; Lead Free: Lead Free; ComponentLink1URL: http://www.te.com/commerce/DocumentDelivery/DDEController?Action=srchrtrv&DocNm=1825910&DocType=Customer+Drawing&DocLang=English&src-supplier=Verical; ComponentLink1Description: http://www.te.com/commerce/DocumentDelivery/DDEController?Action=srchrtrv&DocNm=1825910&DocType=Customer+Drawing&DocLang=English&src-supplier=Verical; ComponentLink2URL: http://www.onlinecomponents.com/productFiles/mf-AMP/1825910-6rqpn1825910-6.pdf?src-supplier=Onlinecomponents.com; ComponentLink2Description: http://www.onlinecomponents.com/productFiles/mf-AMP/1825910-6rqpn1825910-6.pdf?src-supplier=Onlinecomponents.com; Category: Switches,Tactile Switches
U1 = ATMEGA328P-PU: IC MCU 8BIT 32KB FLASH 28DIP; Manufacturer: Microchip / Atmel; Core Architecture: AVR; RAM Size: 2KB; Number of PWM Channels: 6; Number of Timers/Counters: 3; Min Supply Voltage: 1.8V; Max Supply Voltage: 5.5V; Interface: I2C,SPI,UART,USART,2-Wire; Number of I/Os: 23; Frequency: 20MHz; Oscillator Type: Internal; Data Bus Width: 8b; Number of SPI Channels: 1; Watchdog Timer: Yes; Peripherals: Brown-out Detect/Reset,POR,PWM,WDT; Supplier 1: Digi-Key; Supplier Part Number 1: ATMEGA328P-PU-ND; Manufacturer Part Number: ATMEGA328P-PU; Stock 1: 35967; Pricing 1: 1=2.63, 25=2.4152, 100=2.19 (USD); Mount: Through Hole; Case/Package: PDIP; Number of Pins: 28; Contact Plating: Tin,Matte; Min Operating Temperature: -40°C; Max Operating Temperature: 85°C; Package Quantity: 14; Series: AVR® ATmega; Number of ADC Channels: 6; Packaging: Rail/Tube; Number of Programmable I/O: 23; Max Frequency: 20MHz; Number of I2C Channels: 1; Memory Type: FLASH; Memory Size: 32KB; Length: 37.4mm; Width: 6.76mm; Height: 3.28mm; Radiation Hardening: No; REACH SVHC: No SVHC; Lead Free: Lead Free; RoHS Compliant: Yes; ComponentLink1URL: http://www.farnell.com/datasheets/2047852.pdf?src-supplier=Element14; ComponentLink1Description: http://www.farnell.com/datasheets/2047852.pdf?src-supplier=Element14; ComponentLink2URL: http://www.rapidonline.com/pdf/73-4283.pdf?src-supplier=Rapid+Electronics; ComponentLink2Description: http://www.rapidonline.com/pdf/73-4283.pdf?src-supplier=Rapid+Electronics; ComponentLink3URL: http://www.microchip.com/mymicrochip/filehandler.aspx?ddocname=en589968&src-supplier=Verical; ComponentLink3Description: http://www.microchip.com/mymicrochip/filehandler.aspx?ddocname=en589968&src-supplier=Verical; ComponentLink4URL: http://www.produktinfo.conrad.com/datenblaetter/150000-174999/155197-da-01-en-MICROCONTR_ATMEGA328P_PU_8BIT_PDIP_28.pdf?src-supplier=Conrad; ComponentLink4Description: http://www.produktinfo.conrad.com/datenblaetter/150000-174999/155197-da-01-en-MICROCONTR_ATMEGA328P_PU_8BIT_PDIP_28.pdf?src-supplier=Conrad; ComponentLink5URL: http://datasheet.iiic.cc/atmel/ATMEGA328P-PU.pdf?src-supplier=IIIC; ComponentLink5Description: http://datasheet.iiic.cc/atmel/ATMEGA328P-PU.pdf?src-supplier=IIIC; Category: Integrated Circuits (ICs) Embedded - Microcontrollers
U2 = ATMEGA16U2-AU: IC MCU 8BIT 16KB FLASH 32TQFP; Manufacturer: Microchip; Core Architecture: AVR; Interface: SPI,USB,UART,USART; Peripherals: Brown-out Detect/Reset,POR,PWM,WDT; Frequency: 16MHz; Number of I/Os: 22; Oscillator Type: Internal; Supplier 1: Digi-Key; Supplier Part Number 1: ATMEGA16U2-AU-ND; Manufacturer Part Number: ATMEGA16U2-AU; Stock 1: 8933; Pricing 1: 1=3.16, 25=2.9096, 100=2.6335 (USD); Case/Package: TQFP; Number of Pins: 32; Min Operating Temperature: -40°C; Max Operating Temperature: 85°C; Memory Type: FLASH; Packaging: Tray; Memory Size: 16KB; RoHS Compliant: Yes; Category: Integrated Circuits (ICs) Embedded - Microcontrollers
U3 = TL1963A-33DCQR: IC REG LINEAR 3.3V 1.5A SOT223-6; Manufacturer: Texas Instruments; Dropout Voltage: 340mV; Number of Outputs: 1; Max Input Voltage: 20V; Min Input Voltage: 2.1V; Min Current Limit: 1.6A; Input Bias Current: 1mA; Polarity: Positive; Accuracy: 3%; Output Type: Fixed; Supplier 1: Digi-Key; Supplier Part Number 1: 296-24534-6-ND; Manufacturer Part Number: TL1963A-33DCQR; Stock 1: 0; Pricing 1: 1=3.59, 10=3.222, 25=3.0456, 100=2.6396, 250=2.5042, 500=2.247, 1000=2.23475 (USD); Case/Package: SOT-223; Number of Pins: 6; Contact Plating: Gold; Min Operating Temperature: -40°C; Max Operating Temperature: 125°C; Package Quantity: 1; Packaging: Tape and Reel; Output Voltage: 3.3V; Output Current: 1.5A; Max Output Current: 1.5A; Number of Regulators: 1; Quiescent Current: 1mA; Max Output Voltage: 3.3V; Min Output Voltage: 3.3V; Series: -; Radiation Hardening: No; Lead Free: Lead Free; RoHS Compliant: Yes; ComponentLink1URL: http://www.ti.com/lit/ds/symlink/tl1963a.pdf?src-supplier=Digi-Key; ComponentLink1Description: http://www.ti.com/lit/ds/symlink/tl1963a.pdf?src-supplier=Digi-Key; ComponentLink2URL: http://www.ti.com/lit/ds/symlink/tl1963a.pdf?src-supplier=Avnet+Europe; ComponentLink2Description: http://www.ti.com/lit/ds/symlink/tl1963a.pdf?src-supplier=Avnet+Europe; Category: Integrated Circuits (ICs) PMIC - Voltage Regulators - Linear
U4-U7 = SN74AHC1G09DBVR: TEXAS INSTRUMENTS - SN74AHC1G09DBVR - AND Gate, 74AHC1G09, 2 Input, 2 V to 5.5 V, SOT-23-5; Output Voltage: 5.5V; Number of Inputs: 2; Propagation Delay: 7.5ns; Min Supply Voltage: 2V; Output Current: 25mA; Number of Outputs: 1; Quiescent Current: 1uA; Low Level Output Current: 8mA; Supplier 1: Digi-Key; Supplier Part Number 1: 296-29202-6-ND; Manufacturer: Texas Instruments; Manufacturer Part Number: SN74AHC1G09DBVR; Stock 1: 0; Pricing 1: 1=0.48, 10=0.356, 25=0.3116, 100=0.2017, 250=0.16696, 500=0.13356, 1000=0.1024 (USD); Mount: Surface Mount; Case/Package: SOT-23; Number of Pins: 5; Contact Plating: Tin,Matte; Min Operating Temperature: -55°C; Max Operating Temperature: 125°C; Package Quantity: 3000; Packaging: Tape and Reel; Max Supply Voltage: 5.5V; Logic Function: AND GATE; Number of Circuits: 1; Number of Gates: 1; Number of Elements: 1; Number of Bits: 1; Series: 74AHC; Technology: CMOS; Radiation Hardening: No; REACH SVHC: No SVHC; Lead Free: Lead Free; RoHS Compliant: Yes; ComponentLink1URL: http://www.ti.com/lit/ds/symlink/sn74ahc1g09.pdf?src-supplier=Digi-Key; ComponentLink1Description: http://www.ti.com/lit/ds/symlink/sn74ahc1g09.pdf?src-supplier=Digi-Key; Category: Integrated Circuits (ICs) Logic - Gates and Inverters
Y1 Y2 = ABM7-16.000MHZ-D2Y-T: CRYSTAL 16.0000MHZ 18PF SMD; Manufacturer: Abracon; Frequency Tolerance: 20ppm; ESR (Equivalent Series Resistance): 50R; Frequency: 16MHz; Frequency Stability: 30ppm; Operating Frequency: 16 MHz; Supplier 1: Digi-Key; Supplier Part Number 1: 535-9840-1-ND; Manufacturer Part Number: ABM7-16.000MHZ-D2Y-T; Stock 1: 0; Pricing 1: 1=0.87, 10=0.773, 50=0.7224, 100=0.6384, 500=0.6048 (USD); Mount: Surface Mount; Case/Package: CSMD; Number of Pins: 2; Min Operating Temperature: -40°C; Max Operating Temperature: 85°C; Load Capacitance: 18pF; Package Quantity: 1000; Tolerance: 20ppm; Packaging: Tape and Reel; Termination: SMD/SMT; Resistor Type: Ceramic; Series: ABM7; Length: 6mm; Width: 3.3mm; Height: 0.055inch; Depth: 3.5mm; Radiation Hardening: No; REACH SVHC: Unknown; Lead Free: Lead Free; ComponentLink1URL: http://www.abracon.com/Resonators/abm7.pdf?src-supplier=Farnell; ComponentLink1Description: http://www.abracon.com/Resonators/abm7.pdf?src-supplier=Farnell; ComponentLink2URL: http://www.farnell.com/datasheets/947971.pdf?src-supplier=Element14; ComponentLink2Description: http://www.farnell.com/datasheets/947971.pdf?src-supplier=Element14; ComponentLink3URL: https://abracon.com/Resonators/abm7.pdf?src-supplier=Digi-Key; ComponentLink3Description: https://abracon.com/Resonators/abm7.pdf?src-supplier=Digi-Key; ComponentLink4URL: https://www.verical.com/server-webapp/html/getDatasheet?partID=721624&src-supplier=Verical; ComponentLink4Description: https://www.verical.com/server-webapp/html/getDatasheet?partID=721624&src-supplier=Verical; ComponentLink5URL: http://www.abracon.com/Resonators/abm7.pdf?src-supplier=Future+Electronics; ComponentLink5Description: http://www.abracon.com/Resonators/abm7.pdf?src-supplier=Future+Electronics; ComponentLink6URL: http://www.abracon.com/Support/PackageDrawing/Resonators/ABM7.PDF?src-supplier=Verical; ComponentLink6Description: http://www.abracon.com/Support/PackageDrawing/Resonators/ABM7.PDF?src-supplier=Verical; Category: Crystals, Oscillators, Resonators Crystals
Z1 Z2 = CG0603MLC-05E: VARISTOR 0603; Manufacturer: Bourns; Capacitance: 0.5pF; Voltage Rating (DC): 5V; Voltage Rating (AC): 8V; Number of Channels: 1; Clamping Voltage: 20V; Current Rating: 50nA; Turn-On Delay Time: 1ns; Element Configuration: Single; Supplier 1: Digi-Key; Supplier Part Number 1: CG0603MLC-05EDKR-ND; Manufacturer Part Number: CG0603MLC-05E; Stock 1: 116684; Pricing 1: 1=0.49, 10=0.348, 25=0.286, 100=0.2288, 250=0.1664, 500=0.1352, 1000=0.104, 2500=0.0936 (USD); Case/Package: 0603; Number of Pins: 2; Case Code (Imperial): 0603; Case Code (Metric): 1608; Contact Plating: Tin; Min Operating Temperature: -40°C; Max Operating Temperature: 85°C; Operating Supply Voltage: 5V; Package Quantity: 1; Packaging: Tape and Reel; Termination: SMD/SMT; Voltage: 5V; Number of Circuits: 1; Max Voltage Rating (DC): 5V; Working Voltage: 5V; Leakage Current: 50nA; Series: MLC; Length: 1.6mm; Width: 0.8mm; Depth: 0.8mm; Thickness: 0.8mm; Radiation Hardening: No; REACH SVHC: No SVHC; RoHS Compliant: Yes; ComponentLink1URL: http://www.jameco.com/Jameco/Products/ProdDS/1163231.pdf?src-supplier=Jameco; ComponentLink1Description: http://www.jameco.com/Jameco/Products/ProdDS/1163231.pdf?src-supplier=Jameco; ComponentLink2URL: http://www.farnell.com/datasheets/2360367.pdf?src-supplier=Element14; ComponentLink2Description: http://www.farnell.com/datasheets/2360367.pdf?src-supplier=Element14; ComponentLink3URL: http://www.bourns.com/docs/Product-Datasheets/MLC.pdf?src-supplier=Avnet; ComponentLink3Description: http://www.bourns.com/docs/Product-Datasheets/MLC.pdf?src-supplier=Avnet; ComponentLink4URL: http://www.bourns.com/docs/Product-Datasheets/MLC.pdf?src-supplier=Avnet+Europe; ComponentLink4Description: http://www.bourns.com/docs/Product-Datasheets/MLC.pdf?src-supplier=Avnet+Europe; ComponentLink5URL: https://www.bourns.com/docs/Product-Datasheets/MLC.pdf?src-supplier=Digi-Key; ComponentLink5Description: https://www.bourns.com/docs/Product-Datasheets/MLC.pdf?src-supplier=Digi-Key; Category: Circuit Protection TVS - Varistors, MOVs